# Altium project MB1261.PrjPcb (part 3 of 3)

## Sheet STMOD+.SchDoc: STMOD+ Interface
size A4; Author: P.A.; CompanyName: STMicroelectronics; Organization: Microcontrollers Division; Address1: 12, Rue Jules HOROWITZ; Address2: 38019 Grenoble; Address3: FRANCE; DocumentNumber: MB1261; Revision: B.01; SheetNumber: 14; SheetTotal: 15; Project: STM32L496G-DISCO
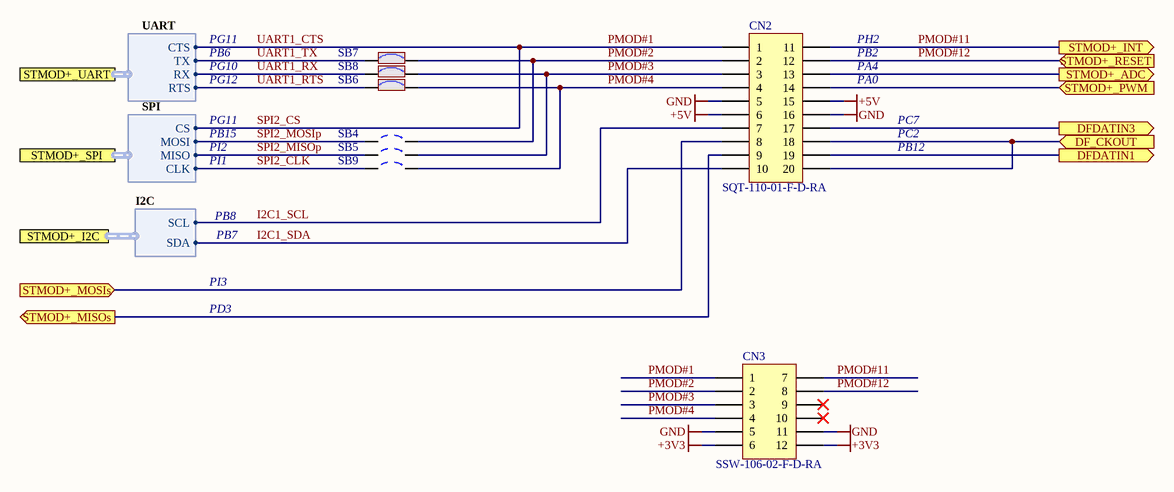
[diagram p13: STMOD+.SchDoc]

### Parts
CN2  SQT-110-01-F-D-RA  [SQT-110-01-F-D-RA]
CN3  SSW-106-02-F-D-RA  [SSW-106-02-F-D-RA]
SB4  Solder Bridge OFF  [SB_0603]  (value not drawn)
SB5  Solder Bridge OFF  [SB_0603]  (value not drawn)
SB6  Solder Bridge ON  [SB_0603]  (value not drawn)
SB7  Solder Bridge ON  [SB_0603]  (value not drawn)
SB8  Solder Bridge ON  [SB_0603]  (value not drawn)
SB9  Solder Bridge OFF  [SB_0603]  (value not drawn)

### Ports
DF_CKOUT (in), DFDATIN1 (out), DFDATIN3 (out), STMOD+_ADC (out), STMOD+_I2C (harness I2C), STMOD+_INT (out), STMOD+_MISOs (out), STMOD+_MOSIs (in), STMOD+_PWM (in), STMOD+_RESET (in), STMOD+_SPI (harness SPI), STMOD+_UART (harness UART)

### Harnesses
UART: RX, TX, RTS, CTS
SPI: MISO, MOSI, CLK, CS
I2C: SDA, SCL

### Nets
+3V3: CN3.6 CN3.12  [project net 3V3_OUT]
+5V: CN2.6 CN2.15
GND: CN2.5 CN2.16 CN3.5 CN3.11
CKOUT: CN2.18 CN2.20 ; port DF_CKOUT
DATIN3: CN2.17 ; port DFDATIN3
DFDATIN1: CN2.19 ; port DFDATIN1
I2C1_SCL: CN2.7 ; port STMOD+_I2C.SCL  [project net ARD_D15]
I2C1_SDA: CN2.10 ; port STMOD+_I2C.SDA  [project net ARD_D14]
PMOD#1: CN2.1 CN3.1 ; port STMOD+_UART.CTS, port STMOD+_SPI.CS  [also labelled SPI2_CS, UART1_CTS]
PMOD#2: CN2.2 CN3.2 SB4.2 SB7.2
PMOD#3: CN2.3 CN3.3 SB5.2 SB8.2
PMOD#4: CN2.4 CN3.4 SB6.2 SB9.2
PMOD#11: CN2.11 CN3.7 ; port STMOD+_INT
PMOD#12: CN2.12 CN3.8 ; port STMOD+_RESET
SPI2_CLK: SB9.1 ; port STMOD+_SPI.CLK
SPI2_MISOp: SB5.1 ; port STMOD+_SPI.MISO  [project net SPI2_MISO]
SPI2_MISOs: CN2.9 ; port STMOD+_MISOs
SPI2_MOSIp: SB4.1 ; port STMOD+_SPI.MOSI  [project net SPI2_MOSI]
SPI2_MOSIs: CN2.8 ; port STMOD+_MOSIs
STMOD+_ADC: CN2.13 ; port STMOD+_ADC
STMOD+_PWM: CN2.14 ; port STMOD+_PWM
UART1_RTS: SB6.1 ; port STMOD+_UART.RTS
UART1_RX: SB8.1 ; port STMOD+_UART.RX
UART1_TX: SB7.1 ; port STMOD+_UART.TX

Not connected (* = marked no-connect by the designer): CN3 9* 10*

### Notes on the sheet
- PG11
- PH2
- PG10
- PG12
- PB6
- PA0
- PA4
- PB2
- PB15
- PI1
- PI2
- PB12
- PC2
- PC7
- PB8
- PB7
- PD3
- PI3
- Title:
- Project:
- Size:
- Revision:
- Variant:
- A4
- -
- Date:
- Reference:
- Sheet:
- of

### Library data of the parts
CN2 = Header 10X2A: Header, 10-Pin, Dual row; Manuf_1: ATOM; Manuf_Part_1: FH200210C-12000; Ordered by: Subcon
CN3 = Header 6X2A: Header, 6-Pin, Dual row; Manuf_Part_1: FH254206C-1600; Manuf_1: ATOM; Ordered by: Subcon
SB4 SB5 SB9 = SB_OFF: Solder: NO; Revision: July-2002: Re-released for DXP Platform.; ECCN_US/EU: N/A
SB6-SB8 = SB_ON: Manuf_1: YAGEO; Manuf_Part_1: RC0603JR-070RL; Solder: YES; Ordered By: Subcon; Revision: July-2002: Re-released for DXP Platform.; ECCN_US/EU: N/A

## Sheet Audio.SchDoc: Audio&DFSDM
size A4; Author: P.A.; CompanyName: STMicroelectronics; Organization: Microcontrollers Division; Address1: 12, Rue Jules HOROWITZ; Address2: 38019 Grenoble; Address3: FRANCE; DocumentNumber: MB1261; Revision: B.01; SheetNumber: 15; SheetTotal: 15; Project: STM32L496G-DISCO
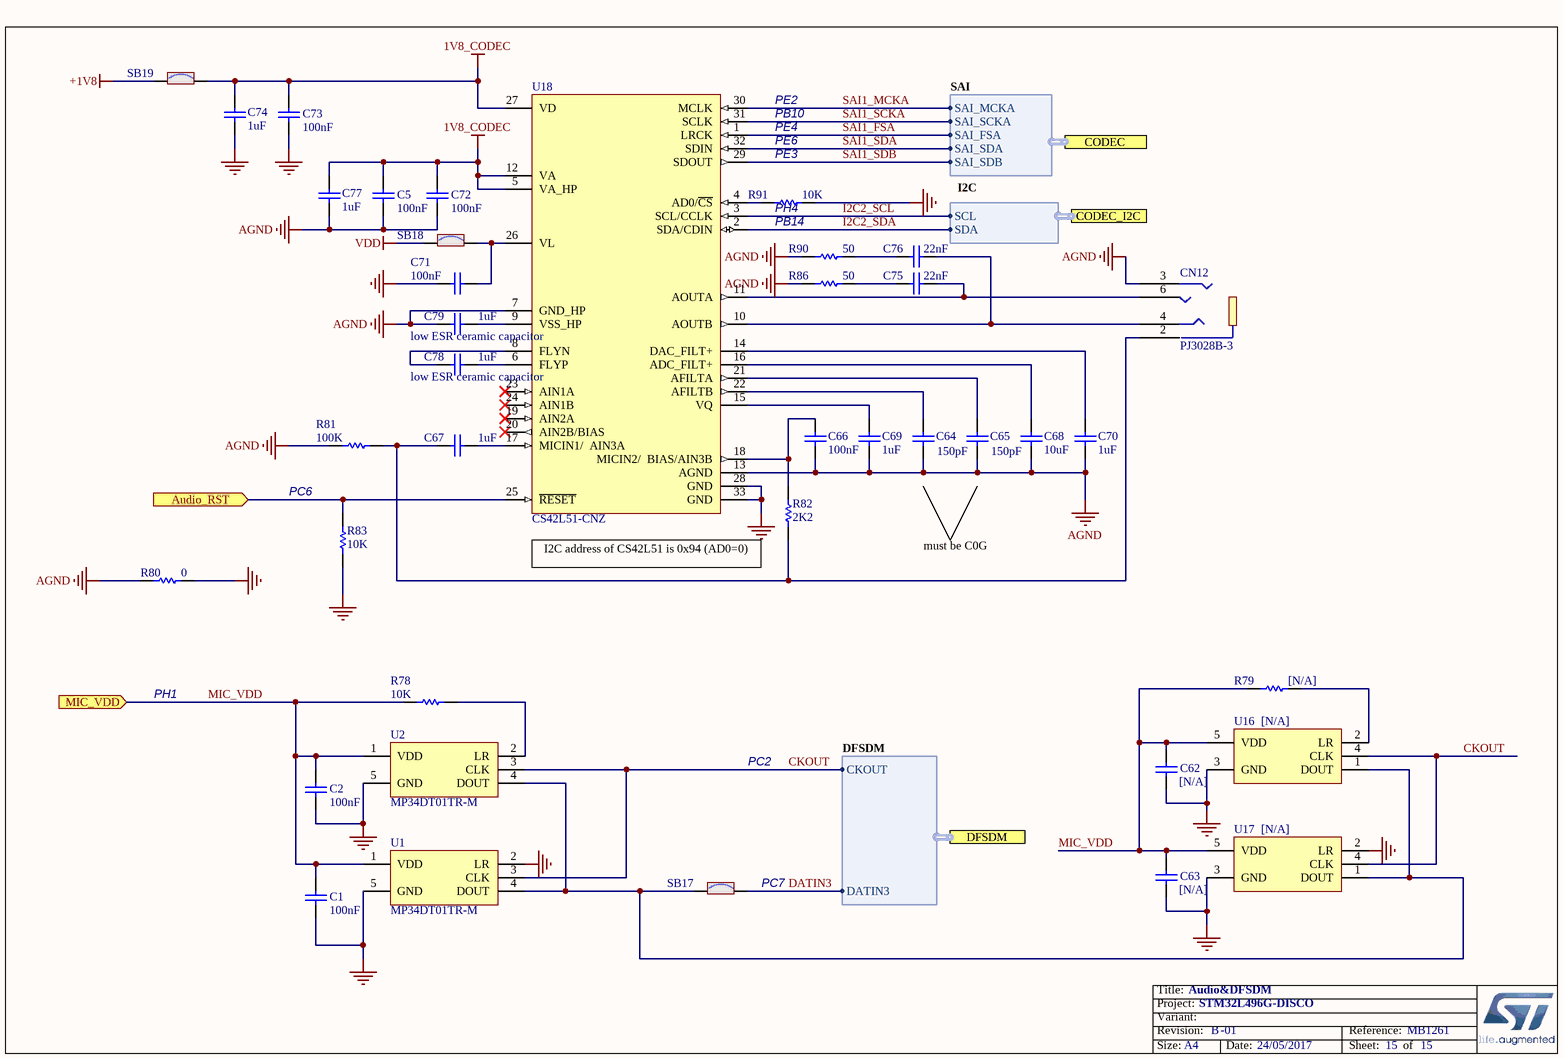
[diagram p14: Audio.SchDoc]

### Parts
C1  value 100nF  [0603C]  (hidden comment: CC0603KRX7R7BB104)
C2  value 100nF  [0603C]  (hidden comment: CC0603KRX7R7BB104)
C5  value 100nF  [0603C]  (hidden comment: CC0603KRX7R7BB104)
C62  [N/A]  [0603C]
C63  [N/A]  [0603C]
C64  value 150pF  [0603C]  (hidden comment: CC0603JRNPO9BN151)
C65  value 150pF  [0603C]  (hidden comment: CC0603JRNPO9BN151)
C66  value 100nF  [0603C]  (hidden comment: CC0603KRX7R7BB104)
C67  value 1uF  [0603C]  (hidden comment: CC0603KRX5R7BB105)
C68  value 10uF  [0603C]  (hidden comment: C1608X5R1A106KT000E)
C69  value 1uF  [0603C]  (hidden comment: CC0603KRX5R7BB105)
C70  value 1uF  [0603C]  (hidden comment: CC0603KRX5R7BB105)
C71  value 100nF  [0603C]  (hidden comment: CC0603KRX7R7BB104)
C72  value 100nF  [0603C]  (hidden comment: CC0603KRX7R7BB104)
C73  value 100nF  [0603C]  (hidden comment: CC0603KRX7R7BB104)
C74  value 1uF  [0603C]  (hidden comment: CC0603KRX5R7BB105)
C75  value 22nF  [0603C]  (hidden comment: CC0603KRX7R8BB223)
C76  value 22nF  [0603C]  (hidden comment: CC0603KRX7R8BB223)
C77  value 1uF  [0603C]  (hidden comment: CC0603KRX5R7BB105)
C78  value 1uF  [0603C]  (hidden comment: CC0603KRX5R7BB105)
C79  value 1uF  [0603C]  (hidden comment: CC0603KRX5R7BB105)
CN12  PJ3028B-3  [PJ3028B]
R78  value 10K  [0603R]  (hidden comment: RC0603FR-0710KL)
R79  [N/A]  [0603R]
R80  value 0  [0603R]  (hidden comment: RC0603JR-070RL)
R81  value 100K  [0603R]  (hidden comment: RC0603FR-07100KL)
R82  value 2K2  [0603R]  (hidden comment: RC0603FR-072K2L)
R83  value 10K  [0603R]  (hidden comment: RC0603FR-0710KL)
R86  value 50  [0603R]  (hidden comment: RC0603FR-0750RL)
R90  value 50  [0603R]  (hidden comment: RC0603FR-0750RL)
R91  value 10K  [0603R]  (hidden comment: RC0603FR-0710KL)
SB17  Solder Bridge ON  [SB_0603]  (value not drawn)
SB18  Solder Bridge ON  [SB_0603]  (value not drawn)
SB19  Solder Bridge ON  [SB_0603]  (value not drawn)
U1  MP34DT01TR-M  [MP34DT01TR]
U2  MP34DT01TR-M  [MP34DT01TR]
U16  [N/A]  [RHLGA5LD]
U17  [N/A]  [RHLGA5LD]
U18  CS42L51-CNZ  [QFN32_0R5_5X5]

### Ports
Audio_RST (in), CODEC (harness SAI), CODEC_I2C (harness I2C), DFSDM (harness DFSDM), MIC_VDD (in)

### Harnesses
SAI: SAI_SDB, SAI_FSA, SAI_MCKA, SAI_SDA, SAI_SCKA
I2C: SDA, SCL
DFSDM: DATIN3, CKOUT

### Nets
1V8_CODEC: C5.1 C72.1 C73.1 C74.1 C77.1 SB19.2 U18.5(VA_HP) U18.12(VA) U18.27(VD)
+1V8: SB19.1  [project net 1V8_OUT]
AGND: C5.2 C64.2 C65.2 C66.1 C68.1 C69.1 C70.1 C72.2 C77.2 C79.1 CN12.3 R80.2 R81.2 R86.2 R90.2 U18.7(GND_HP) U18.13(AGND)
GND: C1.2 C2.2 C62.2 C63.2 C71.1 C73.2 C74.2 R80.1 R83.1 R91.1 U1.2(LR) U1.5(GND) U2.5(GND) U16.3(GND) U17.2(LR) U17.3(GND) U18.28(GND) U18.33(GND)
VDD: SB18.1
Audio_RST: R83.2 U18.25(~{RESET}) ; port Audio_RST
CKOUT: U1.3(CLK) U2.3(CLK) U16.4(CLK) U17.4(CLK) ; port DFSDM.CKOUT
DATIN3: SB17.2 ; port DFSDM.DATIN3
I2C2_SCL: U18.3(SCL/CCLK) ; port CODEC_I2C.SCL
I2C2_SDA: U18.2(SDA/CDIN) ; port CODEC_I2C.SDA
MIC_VDD: C1.1 C2.1 C62.1 C63.1 R78.2 R79.2 U1.1(VDD) U2.1(VDD) U16.5(VDD) U17.5(VDD) ; port MIC_VDD
SAI1_FSA: U18.1(LRCK) ; port CODEC.SAI_FSA
SAI1_MCKA: U18.30(MCLK) ; port CODEC.SAI_MCKA
SAI1_SCKA: U18.31(SCLK) ; port CODEC.SAI_SCKA
SAI1_SDA: U18.32(SDIN) ; port CODEC.SAI_SDA
SAI1_SDB: U18.29(SDOUT) ; port CODEC.SAI_SDB
NetC64_1: C64.1 U18.22(AFILTB)
NetC65_1: C65.1 U18.21(AFILTA)
NetC66_2: C66.2 R82.2 U18.18(MICIN2/__BIAS/AIN3B)
NetC67_1: C67.1 CN12.2 R81.1 R82.1
NetC67_2: C67.2 U18.17(MICIN1/__AIN3A)
NetC68_2: C68.2 U18.16(ADC_FILT+)
NetC69_2: C69.2 U18.15(VQ)
NetC70_2: C70.2 U18.14(DAC_FILT+)
NetC71_2: C71.2 SB18.2 U18.26(VL)
NetC75_1: C75.1 CN12.6 U18.11(AOUTA)
NetC75_2: C75.2 R86.1
NetC76_1: C76.1 CN12.4 U18.10(AOUTB)
NetC76_2: C76.2 R90.1
NetC78_1: C78.1 U18.8(FLYN)
NetC78_2: C78.2 U18.6(FLYP)
NetC79_2: C79.2 U18.9(VSS_HP)
NetR78_1: R78.1 U2.2(LR)
NetR79_1: R79.1 U16.2(LR)
NetR91_2: R91.2 U18.4(AD0/~{CS})
NetSB17_1: SB17.1 U1.4(DOUT) U2.4(DOUT) U16.1(DOUT) U17.1(DOUT)

Not connected (* = marked no-connect by the designer): U18 19(AIN2A)* 20(AIN2B/BIAS)* 23(AIN1A)* 24(AIN1B)*

### Notes on the sheet
- PB10
- PE2
- PE4
- PE6
- PE3
- (near R91) PH4
- (near R91) PB14
- (near U18) low ESR ceramic capacitor
- PC6
- I2C address of CS42L51 is 0x94 (AD0=0)
- must be C0G
- PH1
- PC2
- (near SB17) PC7
- Title:
- Project:
- Size:
- Revision:
- Variant:
- A4
- -
- Date:
- Reference:
- Sheet:
- of

### Library data of the parts
C1 C2 C5 C66 C71-C73 = Cap: Capacitor,100nF,10%,16V,X7R,0603,YAGEO; Ordered by: Subcon; Published: 8-Jun-2000; Revision: July-2002: Re-released for DXP Platform.; Publisher: Altium Limited; Manuf_1: YAGEO; Manuf_Part_1: CC0603KRX7R7BB104
C62 C63 = Cap: Capacitor,100nF,10%,16V,X7R,0603,YAGEO; Manuf_Part_1: CC0603KRX7R7BB104; Ordered by: Subcon; Published: 8-Jun-2000; Revision: July-2002: Re-released for DXP Platform.; Publisher: Altium Limited; Value: 100nF; Manuf_1: YAGEO
C64 C65 = Cap: Capacitor,150pF,0603,50V,5%,NPO; Manuf_1: YAGEO; Ordered by: Subcon; ECCN_US/EU: NA; Published: 8-Jun-2000; Revision: July-2002: Re-released for DXP Platform.; Publisher: Altium Limited; Manuf_Part_1: CC0603JRNPO9BN151
C67 C69 C70 C74 C77-C79 = Cap: Capacitor,1uF,0603,16V,10%,X5R,YAGEO; Ordered by: Subcon; Published: 8-Jun-2000; Revision: July-2002: Re-released for DXP Platform.; Publisher: Altium Limited; Manuf_1: YAGEO; Manuf_Part_1: CC0603KRX5R7BB105
C68 = Cap: Capacitor,10uF,10%,10V,X5R,0603,C1608X5R1A106KT000E; Manuf_1: TDK; Ordered by: Subcon; ECCN_US/EU: NA; Published: 8-Jun-2000; Revision: July-2002: Re-released for DXP Platform.; Publisher: Altium Limited; Manuf_Part_1: C1608X5R1A106KT000E
C75 C76 = Cap: Capacitor,22nF,10%,25V,X7R,0603; Manuf_1: YAGEO; Ordered by: Subcon; ECCN_US/EU: NA; Published: 8-Jun-2000; Revision: July-2002: Re-released for DXP Platform.; Publisher: Altium Limited; Manuf_Part_1: CC0603KRX7R8BB223
CN12 = PJ3028B-3: Manuf_1: QIAOD; Ordered by: Subcon; Silkscreen: AUDIO_JACK; ECCN_US/EU: NA; Manuf_Part_1: PJ3028B-3
R78 R83 R91 = res1: Resistor,10K,0603,1%,YAGEO; Ordered by: Subcon; ECCN_US/EU: NA; Published: 8-Jun-2000; Revision: July-2002: Re-released for DXP Platform.; Publisher: Altium Limited; Manuf_1: YAGEO; Manuf_Part_1: RC0603FR-0710KL
R79 = res1: Resistor,10K,0603,1%,YAGEO; Manuf_Part_1: RC0603FR-0710KL; Ordered by: Subcon; Published: 8-Jun-2000; Revision: July-2002: Re-released for DXP Platform.; Publisher: Altium Limited; Value: 10K; ECCN_US/EU: [N/A]; Manuf_1: YAGEO
R80 = res1: Resistor, 0 ,0603,1%,YAGEO; Ordered by: Subcon; ECCN_US/EU: NA; Published: 8-Jun-2000; Revision: July-2002: Re-released for DXP Platform.; Publisher: Altium Limited; Manuf_1: YAGEO; Manuf_Part_1: RC0603JR-070RL
R81 = res1: as R13-R15 on sheet PSRAM; Published: 8-Jun-2000; Revision: July-2002: Re-released for DXP Platform.; Publisher: Altium Limited; Manuf_1: YAGEO; Manuf_Part_1: RC0603FR-07100KL
R82 = res1: Resistor,2.2K,0603,1%,YAGEO; Ordered by: Subcon; ECCN_US/EU: NA; Published: 8-Jun-2000; Revision: July-2002: Re-released for DXP Platform.; Publisher: Altium Limited; Manuf_1: YAGEO; Manuf_Part_1: RC0603FR-072K2L
R86 R90 = res1: Resistor,50R,0603,1%,YAGEO; Ordered by: Subcon; ECCN_US/EU: NA; Published: 8-Jun-2000; Revision: July-2002: Re-released for DXP Platform.; Publisher: Altium Limited; Manuf_1: YAGEO; Manuf_Part_1: RC0603FR-0750RL
SB17-SB19 = SB_ON: as SB6 on sheet STMOD+; Revision: July-2002: Re-released for DXP Platform.; ECCN_US/EU: N/A
U1 U2 = MP34DT01TR: MEMS audio sensor; Ordered by: STM; ECCN_US/EU: EAR99/NEC; Ref St: 9188008; Revision: 17-Jul-2002: Re-released for DXP Platform.; Publisher: Altium Limited; Manuf_1: STM; Manuf_Part_1: MP34DT01TR-M
U16 U17 = MP23DB01MM: MEMS micro; Manuf_1: STM; ECCN_US/EU: EAR99/NEC; Ref St: 9188010; Fitted: NO; Publisher: STM; Manuf_Part_1: MP23DB01MM; Ordered by: STM
U18 = CS42L51-CNZ: Low-Power, Stereo Codec with Headphone Amp; Manuf_1: Cirrus; Ordered by: Subcon; Manuf_Part_1: CS42L51-CNZ

## Nets that join several sheets
1V8_OUT: Power (5 pins), Audio (SB19.1)
3V3_LCD: LCD (8 pins), PSRAM (R130.2)
3V3_OUT: Arduino_ Connectors (CN15.4 R123.1), LCD (R77.2 T12.4), MCU (JP4.1), Peripherals (LD1.1 LD2.1), Power (5 pins), USB_OTG_FS (R64.1 R74.1 R75.1), STMOD+ (CN3.6 CN3.12)
5V_USB_CHARGER: Power (JP7.9), ST_LINK_V2-1_2 (10 pins)
+5V: IDD_measurement (R116.2 T10.4), LCD (L5.1 R115.1), Power (23 pins), ST_LINK_V2-1_2 (SW1.6), USB_OTG_FS (R58.1 SB16.1), STMOD+ (CN2.6 CN2.15)
ARD_5V: Arduino_ Connectors (CN15.5), Power (JP3.2)
E5V: Arduino_ Connectors (R72.1), Power (C37.1 JP7.3 U10.2 U10.4), ST_LINK_V2-1_2 (D2.1)
GND: Top (H1.1 H2.1 H3.1 H4.1), Arduino_ Connectors (6 pins), Camera (7 pins), IDD_measurement (25 pins), LCD (15 pins), MCU (39 pins), Peripherals (B1.2 B1.3 CN17.6 CN17.9), Power (16 pins), PSRAM (C15.2 C16.2 U4.D1 U4.E6), QSPI (C4.2 U3.4), ST_LINK_V2-1_2 (51 pins), USB_OTG_FS (12 pins), STMOD+ (CN2.5 CN2.16 CN3.5 CN3.11), Audio (18 pins)
U5V_ST_LINK: Power (JP7.1), ST_LINK_V2-1_2 (C29.2 U7.6 U7.7)
VDD: Arduino_ Connectors (CN15.2), Camera (C60.1 C61.1 CN1.20 CN1.30), IDD_measurement (R94.2 R114.1 T8.4), LCD (T11.4), MCU (R21.1 R42.1 R43.1), Peripherals (7 pins), Power (JP5.2), QSPI (R27.2 SB3.1), ST_LINK_V2-1_2 (CN4.1 SW1.5), Audio (SB18.1)
VDD_LCD: LCD (13 pins), PSRAM (R129.2)
VDD_MCU: IDD_measurement (JP2.2 SB24.1), MCU (29 pins)
VIN: Arduino_ Connectors (CN15.8), Power (C45.1 U10.3)
VREF+: Arduino_ Connectors (C3.1 SB2.2), MCU (C13.1 C14.1 R18.1 U5.L1)
ARD_A0: Arduino_ Connectors (CN16.1), MCU (U5.H5)
ARD_A1: Arduino_ Connectors (CN16.2), MCU (U5.J3)
ARD_A2: Arduino_ Connectors (CN16.3), MCU (U5.K1)
ARD_A3: Arduino_ Connectors (CN16.4), MCU (U5.H4)
ARD_A4: Arduino_ Connectors (SB26.1), MCU (U5.N2)
ARD_A5: Arduino_ Connectors (SB28.1), MCU (U5.J2)
ARD_D0: Arduino_ Connectors (CN11.1), MCU (U5.H9)
ARD_D1: Arduino_ Connectors (CN11.2), MCU (U5.H10)
ARD_D2: Arduino_ Connectors (CN11.3), MCU (U5.G7)
ARD_D3: Arduino_ Connectors (CN11.4), MCU (U5.B12)
ARD_D4: Arduino_ Connectors (CN11.5), MCU (U5.C3)
ARD_D5: Arduino_ Connectors (CN11.6), MCU (U5.D4)
ARD_D6: Arduino_ Connectors (CN11.7), MCU (U5.B9)
ARD_D7: Arduino_ Connectors (CN11.8), MCU (U5.G11)
ARD_D8: Arduino_ Connectors (CN10.1), MCU (U5.C6)
ARD_D9: Arduino_ Connectors (CN10.2), MCU (U5.C9)
ARD_D10: Arduino_ Connectors (CN10.3), MCU (U5.A9)
ARD_D11: Arduino_ Connectors (CN10.4), MCU (U5.B5)
ARD_D12: Arduino_ Connectors (CN10.5), MCU (U5.A5)
ARD_D13: Arduino_ Connectors (CN10.6 SB1.2), MCU (U5.K4)
ARD_D14: Arduino_ Connectors (CN10.9 SB25.1), MCU (U5.D5), STMOD+ (CN2.10)
ARD_D15: Arduino_ Connectors (CN10.10 SB27.1), MCU (U5.C4), STMOD+ (CN2.7)
Audio_RST: MCU (U5.F11), Audio (R83.2 U18.25)
CKOUT: MCU (U5.J4), STMOD+ (CN2.18 CN2.20), Audio (U1.3 U2.3 U16.4 U17.4)
CTP_INT: LCD (CN13.2 R89.1), MCU (U5.G6)
D0: LCD (CN6.18), MCU (U5.K10), PSRAM (U4.B6)
D1: LCD (CN6.17), MCU (U5.H11), PSRAM (U4.C5)
D2: LCD (CN6.16), MCU (U5.B8), PSRAM (U4.C6)
D3: LCD (CN6.15), MCU (U5.C8), PSRAM (U4.D5)
D4: LCD (CN6.14), MCU (U5.L7), PSRAM (U4.E5)
D5: LCD (CN6.13), MCU (U5.K7), PSRAM (U4.F5)
D6: LCD (CN6.12), MCU (U5.J7), PSRAM (U4.F6)
D7: LCD (CN6.11), MCU (U5.H7), PSRAM (U4.G6)
D8: LCD (CN6.10), MCU (U5.N8), PSRAM (U4.B1)
D9: LCD (CN6.9), MCU (U5.M8), PSRAM (U4.C1)
D10: LCD (CN6.8), MCU (U5.L8), PSRAM (U4.C2)
D11: LCD (CN6.7), MCU (U5.K8), PSRAM (U4.D2)
D12: LCD (CN6.6), MCU (U5.J8), PSRAM (U4.E2)
D13: LCD (CN6.5), MCU (U5.L11), PSRAM (U4.F2)
D14: LCD (CN6.4), MCU (U5.L10), PSRAM (U4.F1)
D15: LCD (CN6.3), MCU (U5.J13), PSRAM (U4.G1)
D_N: MCU (U5.E13), USB_OTG_FS (CN8.2 D5.4)
D_P: MCU (U5.D13), USB_OTG_FS (CN8.3 D5.3)
DATIN3: MCU (U5.G12), STMOD+ (CN2.17), Audio (SB17.2)
DCMI_CLK: Camera (R100.2), MCU (U5.G8)
DCMI_D0: Camera (CN1.4), MCU (U5.D11)
DCMI_D1: Camera (CN1.5), MCU (U5.M9)
DCMI_D2: Camera (CN1.6), MCU (U5.M10)
DCMI_D3: Camera (CN1.7), MCU (U5.B13)
DCMI_D4: Camera (CN1.8), MCU (U5.A13)
DCMI_D5: Camera (CN1.9), MCU (U5.D10)
DCMI_D6: Camera (CN1.10), MCU (U5.E4)
DCMI_D7: Camera (CN1.11), MCU (U5.B2)
DCMI_HSYNC: Camera (CN1.17), MCU (U5.N10)
DCMI_PIXCK: Camera (CN1.15), MCU (U5.L9)
DCMI_PWR_EN: Camera (CN1.25), IDD_measurement (U21.16)
DCMI_VSYNC: Camera (CN1.19), MCU (U5.E10)
DFDATIN1: MCU (U5.N12), STMOD+ (CN2.19)
I2C2_SCL: IDD_measurement (U21.42), MCU (R42.2 U5.K9)
I2C2_SDA: IDD_measurement (U21.43), MCU (R43.2 U5.M13)
JOY_DOWN: MCU (U5.A1), Peripherals (B2.3)
JOY_LEFT: MCU (U5.B1), Peripherals (B2.1)
JOY_RIGHT: MCU (U5.M5), Peripherals (B2.4)
JOY_SEL: MCU (U5.E1), Peripherals (B2.2)
JOY_UP: MCU (U5.C11), Peripherals (B2.6)
LCD_BL: LCD (R76.1 R77.1 U15.7), MCU (U5.A12)
LCD_NE: LCD (CN6.22 R52.1), MCU (U5.F7)
LCD_OE: LCD (CN6.19), MCU (U5.C7), PSRAM (U4.A2)
LCD_PWR_ON: LCD (R115.2 T11.3 T12.3), MCU (U5.H1)
LCD_RS: LCD (CN6.21), MCU (U5.K13), PSRAM (U4.H1)
LCD_RST: IDD_measurement (U21.20), LCD (CN6.23 R117.2)
LCD_TE: LCD (CN6.2), MCU (U5.D12)
LCD_WE: LCD (CN6.20), MCU (U5.D7), PSRAM (U4.G5)
LED1: MCU (U5.N13), Peripherals (R2.1)
MFX_IRQ_OUT: IDD_measurement (U21.46), MCU (U5.J5)
MFX_WAKEUP: IDD_measurement (R109.2 U21.2), MCU (U5.E11)
MIC_VDD: MCU (U5.J1), Audio (10 pins)
NetCN13_7: IDD_measurement (U21.19), LCD (CN13.7 R99.1 R104.1)
NetR1_1: IDD_measurement (U21.40), Peripherals (R1.1)
NRST: Arduino_ Connectors (CN15.3), IDD_measurement (D6.2), ST_LINK_V2-1_2 (R25.2 SW1.7)
NRST: MCU (C10.1 U5.H3), Peripherals (B1.1 B1.4)
PMOD#1: MCU (U5.E6), STMOD+ (CN2.1 CN3.1)
PMOD#11: MCU (U5.A2), STMOD+ (CN2.11 CN3.7)
PMOD#12: MCU (U5.N5), STMOD+ (CN2.12 CN3.8)
PSRAM_A0: MCU (U5.F5), PSRAM (U4.A3)
PSRAM_A1: MCU (U5.F4), PSRAM (U4.A4)
PSRAM_A2: MCU (U5.F3), PSRAM (U4.A5)
PSRAM_A3: MCU (U5.G3), PSRAM (U4.B3)
PSRAM_A4: MCU (U5.G4), PSRAM (U4.B4)
PSRAM_A5: MCU (U5.G5), PSRAM (U4.C3)
PSRAM_A6: MCU (U5.N6), PSRAM (U4.C4)
PSRAM_A7: MCU (U5.M6), PSRAM (U4.D4)
PSRAM_A8: MCU (U5.L6), PSRAM (U4.H2)
PSRAM_A9: MCU (U5.K6), PSRAM (U4.H3)
PSRAM_A10: MCU (U5.J6), PSRAM (U4.H4)
PSRAM_A11: MCU (U5.H6), PSRAM (U4.H5)
PSRAM_A12: MCU (U5.J12), PSRAM (U4.G3)
PSRAM_A13: MCU (U5.J11), PSRAM (U4.G4)
PSRAM_A14: MCU (U5.J10), PSRAM (U4.F3)
PSRAM_A15: MCU (U5.J9), PSRAM (U4.F4)
PSRAM_A16: MCU (U5.K12), PSRAM (U4.E4)
PSRAM_A17: MCU (U5.K11), PSRAM (U4.D3)
PSRAM_NBL0: MCU (U5.A4), PSRAM (U4.A1)
PSRAM_NBL1: MCU (U5.B4), PSRAM (R13.1 U4.B2)
PSRAM_NE: MCU (U5.B7), PSRAM (JP9.1 R12.2)
QSPI_BK1_IO0: MCU (U5.L5), QSPI (R8.1)
QSPI_BK1_IO1: MCU (U5.K5), QSPI (R28.1)
QSPI_BK1_IO2: MCU (U5.L4), QSPI (R29.1)
QSPI_BK1_IO3: MCU (U5.M4), QSPI (R6.1)
QSPI_BK1_NCS: MCU (U5.H8), QSPI (R26.1)
QSPI_CLK: MCU (U5.M2), QSPI (R7.1)
SAI1_FSA: MCU (U5.D1), Audio (U18.1)
SAI1_MCKA: MCU (U5.D3), Audio (U18.30)
SAI1_SCKA: MCU (U5.N9), Audio (U18.31)
SAI1_SDA: MCU (U5.E3), Audio (U18.32)
SAI1_SDB: MCU (U5.D2), Audio (U18.29)
SPI2_CLK: MCU (U5.B11), STMOD+ (SB9.1)
SPI2_MISO: MCU (U5.B10), STMOD+ (SB5.1)
SPI2_MISOs: MCU (U5.E8), STMOD+ (CN2.9)
SPI2_MOSI: MCU (U5.M12), STMOD+ (SB4.1)
SPI2_MOSIs: MCU (U5.C10), STMOD+ (CN2.8)
STMOD+_ADC: MCU (U5.L3), STMOD+ (CN2.13)
STMOD+_PWM: MCU (U5.K3), STMOD+ (CN2.14)
SWCLK: MCU (U5.A10), ST_LINK_V2-1_2 (R4.2 R47.1)
SWDIO: MCU (U5.A11), ST_LINK_V2-1_2 (R5.2 SW1.8)
SWO: MCU (U5.A6), ST_LINK_V2-1_2 (R16.2 R51.1)
UART1_RTS: MCU (U5.F6), STMOD+ (SB6.1)
UART1_RX: MCU (U5.D6), STMOD+ (SB8.1)
UART1_TX: MCU (U5.C5), STMOD+ (SB7.1)
USART2_RX: MCU (U5.E7), ST_LINK_V2-1_2 (R46.2)
USART2_TX: MCU (U5.N1), ST_LINK_V2-1_2 (R55.1)
USB_OTGFS_ID: MCU (U5.F9), USB_OTG_FS (CN8.4 D5.1)
USB_OTGFS_OVRCR: IDD_measurement (U21.17), USB_OTG_FS (LD7.2 R64.2 U14.3)
USB_OTGFS_VBUS: MCU (U5.F10), Power (JP7.5), ST_LINK_V2-1_2 (D4.1), USB_OTG_FS (5 pins)
uSD_CLK: MCU (U5.F8), Peripherals (CN17.5)
uSD_CMD: MCU (U5.D8), Peripherals (CN17.3 R120.1)
uSD_D0: MCU (U5.G10), Peripherals (CN17.7 R121.1)
uSD_D1: MCU (U5.G9), Peripherals (CN17.8 R122.1)
uSD_D2: MCU (U5.D9), Peripherals (CN17.1 R118.1)
uSD_D3: MCU (U5.E9), Peripherals (CN17.2 R119.1)
uSD_Detect: IDD_measurement (U21.29), Peripherals (CN17.10)